# EAGLE design D1-Garage-Relay (EAGLE 9.6.2)
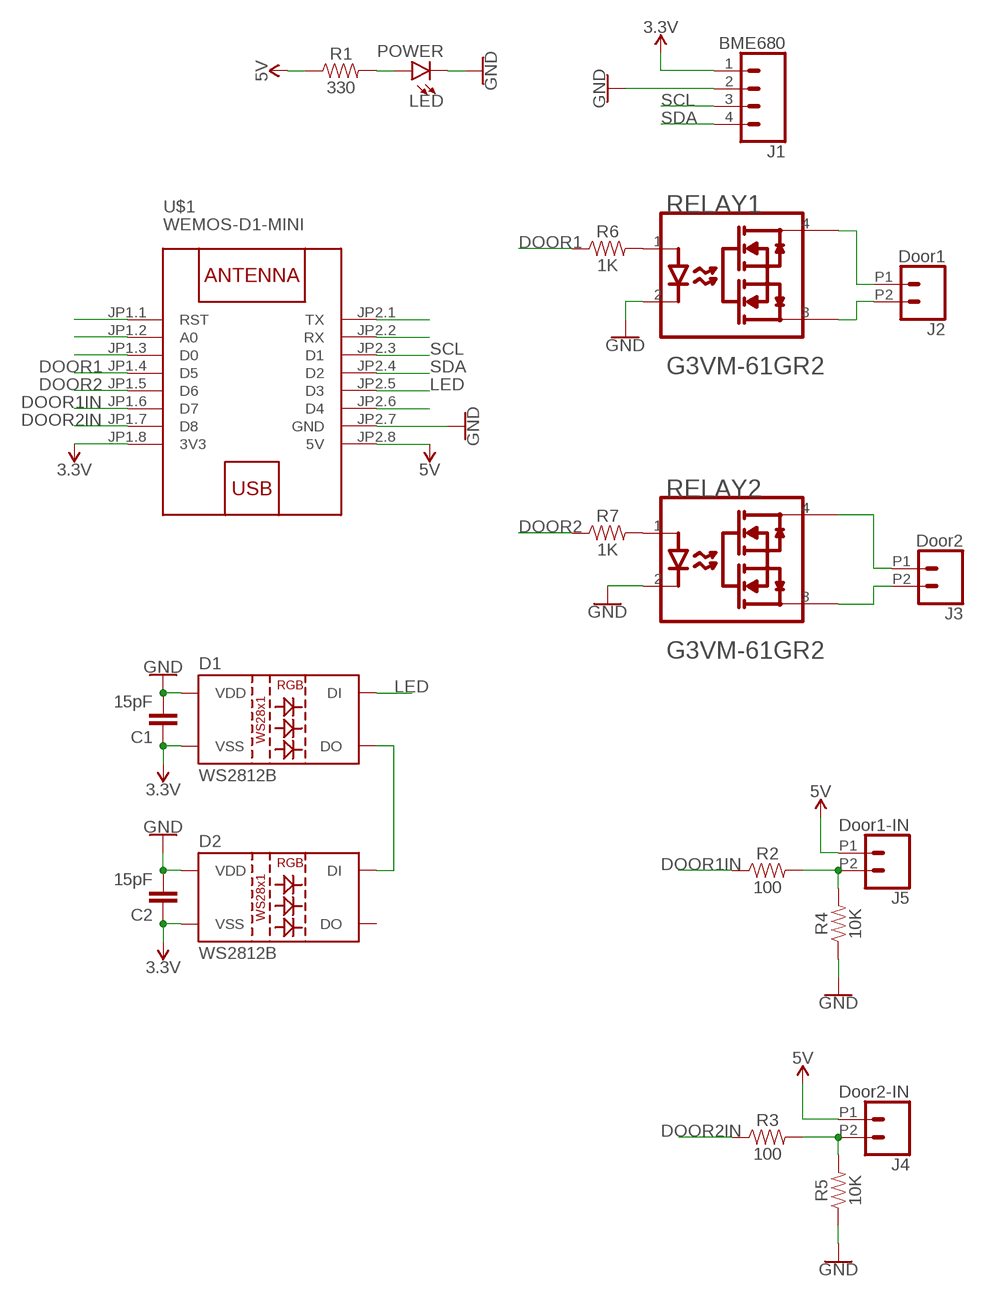
[diagram p0: schematic, sheet 1]

## Parts
C1  15pF  15PF-0603-50V-5%  [0603]
C2  15pF  15PF-0603-50V-5%  [0603]
D1  WS2812B  [WS2812B]
D2  WS2812B  [WS2812B]
J1  BME680  CONN_04  [1X04]
J2  Door1  CONN_022.54MM_SCREWTERM  [1X02_2.54_SCREWTERM]
J3  Door2  CONN_022.54MM_SCREWTERM  [1X02_2.54_SCREWTERM]
J4  Door2-IN  CONN_022.54MM_SCREWTERM  [1X02_2.54_SCREWTERM]
J5  Door1-IN  CONN_022.54MM_SCREWTERM  [1X02_2.54_SCREWTERM]
LED  POWER  LED1206  [LED-1206]
R1  330  RESISTOR0603  [0603]
R2  100  RESISTOR0603  [0603]
R3  100  RESISTOR0603  [0603]
R4  10K  RESISTOR0603  [0603]
R5  10K  RESISTOR0603  [0603]
R6  1K  RESISTOR0603  [0603]
R7  1K  RESISTOR0603  [0603]
RELAY1  AQY282SZ  OMRON_G3VM-61GR2OMRON_G3VM-61GR2_0_3  [OMRON_G3VM-61GR2_3]
RELAY2  AQY282SZ  OMRON_G3VM-61GR2OMRON_G3VM-61GR2_0_3  [OMRON_G3VM-61GR2_3]
U$1  WEMOS-D1-MINI  [WEMOS-D1-MINI]

## Nets
3.3V: C1.1 C2.1 D1.3(VSS) D2.3(VSS) J1.1 U$1.JP1.8(3V3)
5V: J4.P1 J5.P1 R1.1 U$1.JP2.8(5V)
DOOR1: R6.1 U$1.JP1.4(D5)
DOOR1IN: R2.1 U$1.JP1.6(D7)
DOOR2: R7.1 U$1.JP1.5(D6)
DOOR2IN: R3.1 U$1.JP1.7(D8)
GND: C1.2 C2.2 D1.1(VDD) D2.1(VDD) J1.2 LED.C R4.1 R5.1 RELAY1.2(CATHODE) RELAY2.2(CATHODE) U$1.JP2.7(GND)
LED: D1.4(DI) U$1.JP2.5(D3)
N$1: J2.P2 RELAY1.3(1_DRAIN)
N$2: J3.P2 RELAY2.3(1_DRAIN)
N$3: U$1.JP2.1(TX)
N$4: U$1.JP2.2(RX)
N$5: J2.P1 RELAY1.4(2_DRAIN)
N$6: R6.2 RELAY1.1(ANODE)
N$7: J3.P1 RELAY2.4(2_DRAIN)
N$8: U$1.JP2.6(D4)
N$9: R7.2 RELAY2.1(ANODE)
N$11: LED.A R1.2
N$12: J5.P2 R2.2 R4.2
N$13: J4.P2 R3.2 R5.2
N$14: D1.2(DO) D2.4(DI)
N$16: U$1.JP1.3(D0)
N$17: U$1.JP1.2(A0)
N$18: U$1.JP1.1(RST)
SCL: J1.3 U$1.JP2.3(D1)
SDA: J1.4 U$1.JP2.4(D2)
Unconnected: D2.2(DO)

## Library data of the parts
C1 C2 = SparkFun-Capacitors:15PF: 15pF ceramic capacitors A capacitor is a passive two-terminal electrical component used to store electrical energy temporarily in an electric field.; PROD_ID: CAP-07881
D1 D2 = SparkFun-LED:WS2812B: WS2812B SMD addressable RGB LED 5x5mm SMD LED with built-in controller IC. Color: Red/Green/Blue mC Rating: RGB: 390, 660, 180 mcd Forward Voltage: RGB: 2.0, 3.0, 3.0 V Packages:WS2812B SparkFun Products: Blynk Board - ESP8266 <https://www.sparkfun.com/products/13794>; PROD_ID: DIO-12503
J1 = SparkFun-Connectors:CONN_04: Multi connection point. Often used as Generic Header-pin footprint for 0.1 inch spaced/style header connections On any of the 0.1 inch spaced packages, you can populate with these: Break Away Headers - Straight <https://www.sparkfun.com/products/116> (PRT-00116) Break Away Male Headers - Right Angle <https://www.sparkfun.com/products/553> (PRT-00553) Female Headers <https://www.sparkfun.com/products/115> (PRT-00115) Break Away Headers - Machine Pin <https://www.sparkfun.com/products/117> (PRT-00117) Break Away Female Headers - Swiss Machine Pin <https://www.sparkfun.com/products/743> (PRT-00743) For SCREWTERMINALS and SPRING TERMINALS visit here: Screw Terimnals on SparkFun.com <https://www.sparkfun.com/search/results?term=Screw+Terminals> (5mm/3.5mm/2.54mm spacing) This device is also useful as a general connection point to wire up your design to another part of your project. Our various solder wires solder well into these plated through hole pads. Hook-Up Wire - Assortment (Stranded, 22 AWG) <https://www.sparkfun.com/products/11375> (PRT-11375) Hook-Up Wire - Assortment (Solid Core, 22 AWG) <https://www.sparkfun.com/products/11367> (PRT-11367) View the entire wire category on our website here <https://www.sparkfun.com/categories/141> Special notes: Molex polarized connector foot print use with SKU : PRT-08231 with associated crimp pins and housings. 1MM SMD Version SKU: PRT-10208; PROD_ID: CONN-09696
J2-J5 = SparkFun-Connectors:CONN_02: Multi connection point. Often used as Generic Header-pin footprint for 0.1 inch spaced/style header connections On any of the 0.1 inch spaced packages, you can populate with these: Break Away Headers - Straight <https://www.sparkfun.com/products/116> (PRT-00116) Break Away Male Headers - Right Angle <https://www.sparkfun.com/products/553> (PRT-00553) Female Headers <https://www.sparkfun.com/products/115> (PRT-00115) Break Away Headers - Machine Pin <https://www.sparkfun.com/products/117> (PRT-00117) Break Away Female Headers - Swiss Machine Pin <https://www.sparkfun.com/products/743> (PRT-00743) For SCREWTERMINALS and SPRING TERMINALS visit here: Screw Terimnals on SparkFun.com <https://www.sparkfun.com/search/results?term=Screw+Terminals> (5mm/3.5mm/2.54mm spacing) This device is also useful as a general connection point to wire up your design to another part of your project. Our various solder wires solder well into these plated through hole pads. Hook-Up Wire - Assortment (Stranded, 22 AWG) <https://www.sparkfun.com/products/11375> (PRT-11375) Hook-Up Wire - Assortment (Solid Core, 22 AWG) <https://www.sparkfun.com/products/11367> (PRT-11367) View the entire wire category on our website here <https://www.sparkfun.com/categories/141> Special notes: Molex polarized connector foot print use with: PRT-08233 with associated crimp pins and housings. 2.54_SCREWTERM for use with PRT-10571. 3.5mm Screw Terminal footprints for PRT-08084 5mm Screw Terminal footprints for use with PRT-08432
LED = SparkFun-LED:LED: LED (Generic) Standard schematic elements and footprints for 5mm, 3mm, 1206, and 0603 sized LEDs. Generic LEDs with no color specified.
R1-R7 = SparkFun-Resistors:RESISTOR: Generic Resistor Package
RELAY1 RELAY2 = Omron - G3VM-61GR2:OMRON_G3VM-61GR2: Solid State SPST-NO (1 Form A) 4-SOP (0.173", 4.40mm); AMBIENT_TEMPERATURE_RANGE_HIGH: +65°C; AMBIENT_TEMPERATURE_RANGE_LOW: -20°C; AUTOMOTIVE: No; CAPACITANCE: 0.8pF; CENTROID_NOT_SPECIFIED: No; DATASHEET: https://omronfs.omron.com/en_US/ecb/products/pdf/en-g3vm_61gr2.pdf; DEVICE_CLASS_L1: Electromechanical; DEVICE_CLASS_L2: Relays; DEVICE_CLASS_L3: Solid State Relays; DIGIKEY_DESCRIPTION: SSR RELAY SPST-NO 1.7A 0-60V; DIGIKEY_PART_NUMBER: Z8611-ND; FOOTPRINT_PARAMETERS_1: {"fp_type":"PSOP","params":{"N":{"nom":4,"long name":"Number of leads","min":null,"max":null,"short name":"N","type":"count"},"A":{"nom":false,"long name":"Height","min":false,"max":2100000,"short name":"A","type":"measurement"},"A1":{"nom":100000,"long name":"Package clearance","min":0,"max":200000,"short name":"A1","type":"measurement"},"A2":{"nom":false,"long name":"Package height","min":false,"max":2100000,"short name":"A2","type":"measurement"},"D":{"nom":3899999,"long name":"Package length","min":3700000,"max":4099999,"short name":"D","type":"measurement"},"E":{"nom":7000000,"long name":"Width /w leads","min":6600000,"max":7400000,"short name":"E","type":"measurement"},"E1":{"nom":4400000,"long name":"Package width","min":4150000,"max":4650000,"short name":"E1","type":"measurement"},"B":{"nom":400000,"long name":"Lead width","min":300000,"max":500000,"short name":"B","type":"measurement"},"C":{"nom":150000,"long name":"Lead thickness","min":false,"max":false,"short name":"C","type":"measurement"},"L":{"nom":600000,"long name":"Lead foot length","min":300000,"max":900000,"short name":"L","type":"measurement"},"e":{"nom":2540000,"long name":"Lead pitch","min":null,"max":null,"short name":"e","type":"measurement"},"PHI":{"nom":false,"long name":"Lead angle","min":0,"max":8,"short name":"PHI","type":"measurement"},"offset x":{"nom":0,"long name":"X Center offset","min":null,"max":null,"short name":"offset x","type":"measurement"},"offset y":{"nom":0,"long name":"Y Center offset","min":null,"max":null,"short name":"offset y","type":"measurement"},"LS":{"default":"Rounded rectangle","long name":"Land shape","type":"multichoice","short name":"LS"},"LS1":{"default":"Rectangle","long name":"Land shape (Pin 1)","type":"multichoice","short name":"LS1"},"solder toe":{"nom":550000,"long name":"Solder fillet (toe)","min":null,"max":null,"short name":"solder toe","type":"fixedmeasurement"},"solder heel":{"nom":450000,"long name":"Solder fillet (heel)","min":null,"max":null,"short name":"solder heel","type":"fixedmeasurement"},"solder side":{"nom":50000,"long name":"Solder fillet (side)","min":null,"max":null,"short name":"solder side","type":"fixedmeasurement"},"courtyard":{"nom":500000,"long name":"Courtyard","min":null,"max":null,"short name":"courtyard","type":"fixedmeasurement"},"SF":{"default":"A (> 0.625mm pitch)","long name":"Packing level","type":"multichoiceparent","short name":"SF","help":"http://support.upverter.com/customer/portal/articles/978783-what-is-a-footprint-packing-level","children":["solder toe","solder heel","solder side","courtyard"]}}}; FOOTPRINT_PARAMETERS_2: {"fp_type":"PSOP","params":{"N":{"nom":4,"long name":"Number of leads","min":null,"max":null,"short name":"N","type":"count"},"A":{"nom":false,"long name":"Height","min":false,"max":2100000,"short name":"A","type":"measurement"},"A1":{"nom":100000,"long name":"Package clearance","min":0,"max":200000,"short name":"A1","type":"measurement"},"A2":{"nom":false,"long name":"Package height","min":false,"max":2100000,"short name":"A2","type":"measurement"},"D":{"nom":3899999,"long name":"Package length","min":3700000,"max":4099999,"short name":"D","type":"measurement"},"E":{"nom":7000000,"long name":"Width /w leads","min":6600000,"max":7400000,"short name":"E","type":"measurement"},"E1":{"nom":4400000,"long name":"Package width","min":4150000,"max":4650000,"short name":"E1","type":"measurement"},"B":{"nom":400000,"long name":"Lead width","min":300000,"max":500000,"short name":"B","type":"measurement"},"C":{"nom":150000,"long name":"Lead thickness","min":false,"max":false,"short name":"C","type":"measurement"},"L":{"nom":600000,"long name":"Lead foot length","min":300000,"max":900000,"short name":"L","type":"measurement"},"e":{"nom":2540000,"long name":"Lead pitch","min":null,"max":null,"short name":"e","type":"measurement"},"PHI":{"nom":false,"long name":"Lead angle","min":0,"max":8,"short name":"PHI","type":"measurement"},"offset x":{"nom":0,"long name":"X Center offset","min":null,"max":null,"short name":"offset x","type":"measurement"},"offset y":{"nom":0,"long name":"Y Center offset","min":null,"max":null,"short name":"offset y","type":"measurement"},"LS":{"default":"Rounded rectangle","long name":"Land shape","type":"multichoice","short name":"LS"},"LS1":{"default":"Rectangle","long name":"Land shape (Pin 1)","type":"multichoice","short name":"LS1"},"solder toe":{"nom":350000,"long name":"Solder fillet (toe)","min":null,"max":null,"short name":"solder toe","type":"fixedmeasurement"},"solder heel":{"nom":350000,"long name":"Solder fillet (heel)","min":null,"max":null,"short name":"solder heel","type":"fixedmeasurement"},"solder side":{"nom":30000,"long name":"Solder fillet (side)","min":null,"max":null,"short name":"solder side","type":"fixedmeasurement"},"courtyard":{"nom":250000,"long name":"Courtyard","min":null,"max":null,"short name":"courtyard","type":"fixedmeasurement"},"SF":{"default":"B (> 0.625mm pitch)","long name":"Packing level","type":"multichoiceparent","short name":"SF","help":"http://support.upverter.com/customer/portal/articles/978783-what-is-a-footprint-packing-level","children":["solder toe","solder heel","solder side","courtyard"]}}}; FOOTPRINT_PARAMETERS_3: {"fp_type":"PSOP","params":{"N":{"nom":4,"long name":"Number of leads","min":null,"max":null,"short name":"N","type":"count"},"A":{"nom":false,"long name":"Height","min":false,"max":2100000,"short name":"A","type":"measurement"},"A1":{"nom":100000,"long name":"Package clearance","min":0,"max":200000,"short name":"A1","type":"measurement"},"A2":{"nom":false,"long name":"Package height","min":false,"max":2100000,"short name":"A2","type":"measurement"},"D":{"nom":3899999,"long name":"Package length","min":3700000,"max":4099999,"short name":"D","type":"measurement"},"E":{"nom":7000000,"long name":"Width /w leads","min":6600000,"max":7400000,"short name":"E","type":"measurement"},"E1":{"nom":4400000,"long name":"Package width","min":4150000,"max":4650000,"short name":"E1","type":"measurement"},"B":{"nom":400000,"long name":"Lead width","min":300000,"max":500000,"short name":"B","type":"measurement"},"C":{"nom":150000,"long name":"Lead thickness","min":false,"max":false,"short name":"C","type":"measurement"},"L":{"nom":600000,"long name":"Lead foot length","min":300000,"max":900000,"short name":"L","type":"measurement"},"e":{"nom":2540000,"long name":"Lead pitch","min":null,"max":null,"short name":"e","type":"measurement"},"PHI":{"nom":false,"long name":"Lead angle","min":0,"max":8,"short name":"PHI","type":"measurement"},"offset x":{"nom":0,"long name":"X Center offset","min":null,"max":null,"short name":"offset x","type":"measurement"},"offset y":{"nom":0,"long name":"Y Center offset","min":null,"max":null,"short name":"offset y","type":"measurement"},"LS":{"default":"Rounded rectangle","long name":"Land shape","type":"multichoice","short name":"LS"},"LS1":{"default":"Rectangle","long name":"Land shape (Pin 1)","type":"multichoice","short name":"LS1"},"solder toe":{"nom":150000,"long name":"Solder fillet (toe)","min":null,"max":null,"short name":"solder toe","type":"fixedmeasurement"},"solder heel":{"nom":250000,"long name":"Solder fillet (heel)","min":null,"max":null,"short name":"solder heel","type":"fixedmeasurement"},"solder side":{"nom":10000,"long name":"Solder fillet (side)","min":null,"max":null,"short name":"solder side","type":"fixedmeasurement"},"courtyard":{"nom":100000,"long name":"Courtyard","min":null,"max":null,"short name":"courtyard","type":"fixedmeasurement"},"SF":{"default":"C (> 0.625mm pitch)","long name":"Packing level","type":"multichoiceparent","short name":"SF","help":"http://support.upverter.com/customer/portal/articles/978783-what-is-a-footprint-packing-level","children":["solder toe","solder heel","solder side","courtyard"]}}}; FOOTPRINT_VARIANT_NAME_0: Recommended_Land_Pattern; FOOTPRINT_VARIANT_NAME_1: IPC_A; FOOTPRINT_VARIANT_NAME_2: IPC_B; FOOTPRINT_VARIANT_NAME_3: IPC_C; HEIGHT: 2.1mm; INPUT_CURRENT: 10mA; IPC_LAND_PATTERN_NAME: SOP254P700X210-4; ISOLATION_VOLTAGE: 1500Vrms; LEAD_FREE: Yes; MAX_JUNCTION_TEMP: +125°C; MF: Omron; MFG_PACKAGE_IDENT: 0; MFG_PACKAGE_IDENT_DATE: 0; MFG_PACKAGE_IDENT_REV: 0; MOUSER_DESCRIPTION: Relay SSR 25mA 1.48V DC-IN 1.3A 48V AC/DC-OUT 4-Pin SOP T/R; MOUSER_PART_NUMBER: 653-G3VM61GR2; MPN: G3VM-61GR2; NUMBER_OF_CONTACTS: 1; ON_STATE_RESISTANCE: 0.08Ω; OUTPUT_CURRENT: 1.3A; OUTPUT_VOLTAGE: 48V; PACKAGE: SOP4; PREFIX: K; ROHS: Yes; STANDOFF_HEIGHT: 0mm; TEMPERATURE_RANGE_HIGH: +65°C; TEMPERATURE_RANGE_LOW: -20°C; THROW_CONFIGURATION: SPST-NO; VERIFICATION_VERSION: 0.0.0.3
U$1 = diy-modules:WEMOS-D1-MINI: WEMOS D1 mini: Mini Wi-Fi Board based on ESP-8266 device More details can be found here: https://www.wemos.cc/product/d1-mini.html Click here to find device on ebay.com <http://www.ebay.com/sch/wemos+d1+mini+nodemcu>

## Board
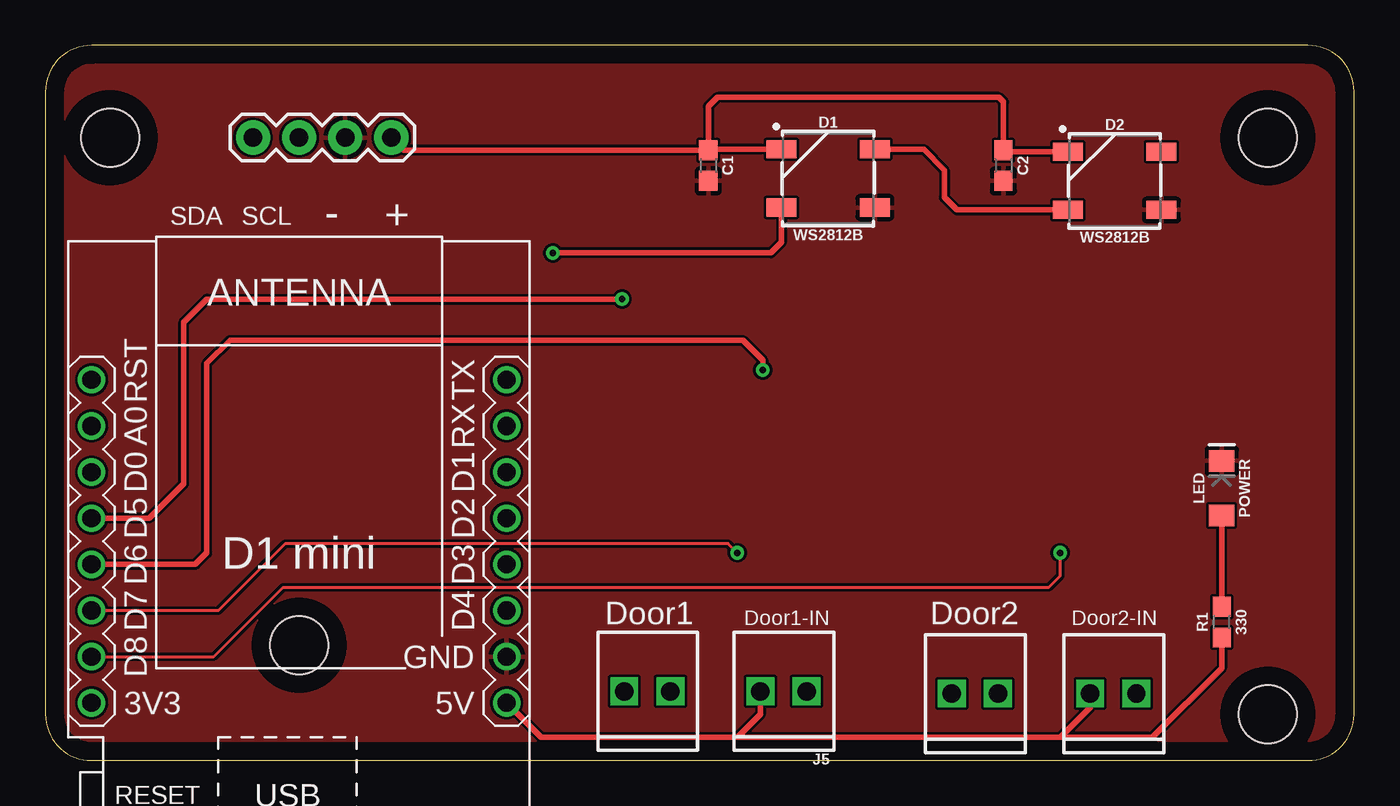
[diagram p1: board, top side]
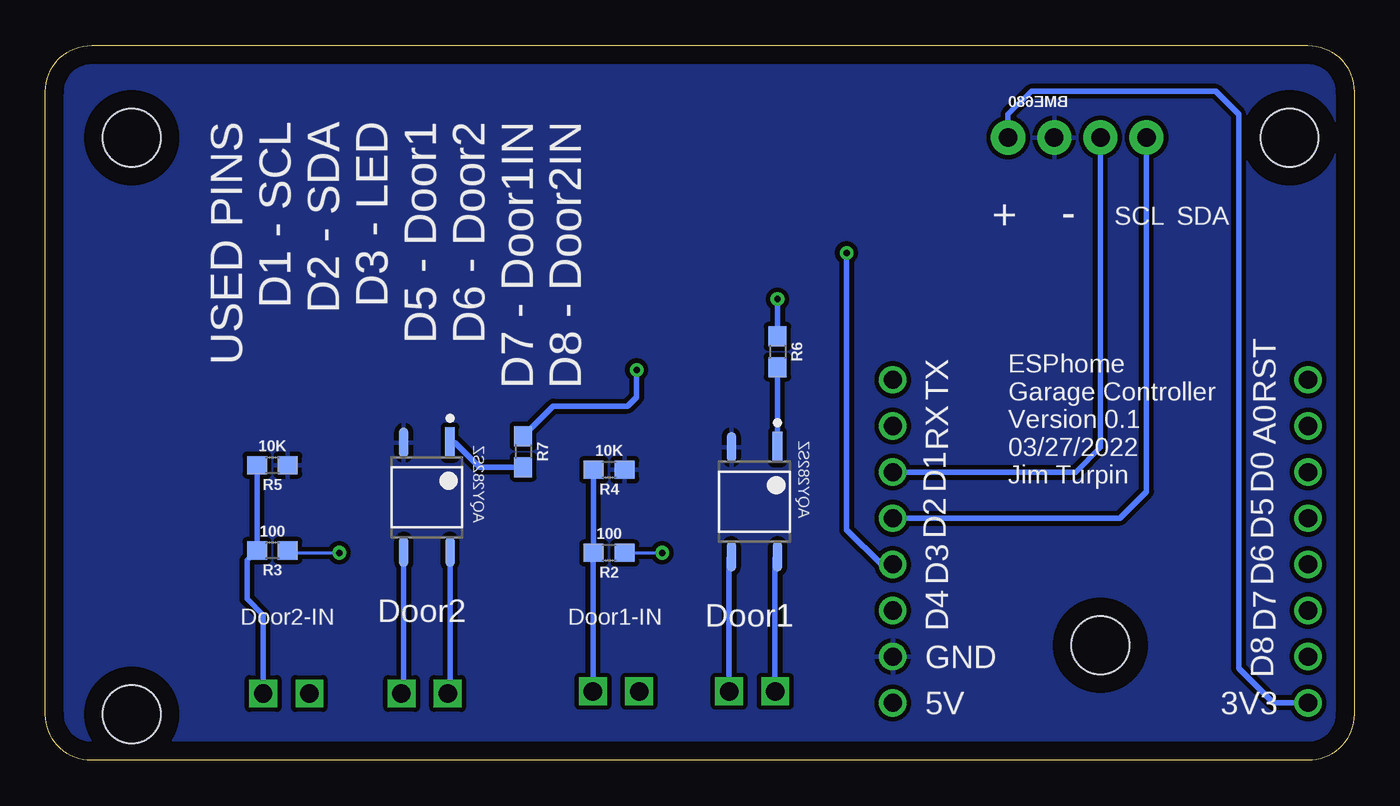
[diagram p2: board, bottom side, seen from below]

Size 72.06 x 39.36 mm. Coordinates in mm from the lower left corner, seen from the top.
Outline: 0,36.82 0,2.54 arc90 2.54,0 69.52,0 arc90 72.06,2.54 72.06,36.82 arc90 69.52,39.36 2.54,39.36 arc90 0,36.82
Copper layers (1*16): Top 0.035mm / dielectric 1.5mm / Bottom 0.035mm
Design rules "default": minimum track width 6mil, minimum drill 0.35mm, track to track 6mil, track to pad 6mil, pad to pad 6mil, via to via 6mil, smd to smd 6mil, copper to edge 40mil, drill to drill 6mil, minimum pad ring 10mil, minimum via ring 8mil, stop-mask expansion 4mil, vias tented up to drill 0mil, thermal gap 10mil
Holes 3.2 mm at 3.56,34.29 67.31,34.29 67.31,2.54 13.97,6.35

### Footprints (pad centres in the part's own frame; a part is rotated, then mirrored left to right if it is on the bottom)
0603 = smd 1.1 x 1: 1 -0.85,0; 2 0.85,0
WS2812B = smd 1.651 x 1: 1 2.577,-1.6; 2 2.577,1.6; 3 -2.577,1.6; 4 -2.577,-1.6
1X04 = drill 1.016 pad 1.88: 1 0,0; 2 2.54,0; 3 5.08,0; 4 7.62,0
1X02_2.54_SCREWTERM = drill 1.016 square: P1 2.54,0; P2 0,0
LED-1206 = smd 1.2 x 1.4: A -1.5,0; C 1.5,0
OMRON_G3VM-61GR2_3 = smd 1.703 x 0.532: 1 -3,1.27; 2 -3,-1.27; 3 3,-1.27; 4 3,1.27
WEMOS-D1-MINI = drill 1: JP1.1 -11.43,9.525; JP1.2 -11.43,6.985; JP1.3 -11.43,4.445; JP1.4 -11.43,1.905; JP1.5 -11.43,-0.635; JP1.6 -11.43,-3.175; JP1.7 -11.43,-5.715; JP1.8 -11.43,-8.255; JP2.1 11.43,9.525; JP2.2 11.43,6.985; JP2.3 11.43,4.445; JP2.4 11.43,1.905; JP2.5 11.43,-0.635; JP2.6 11.43,-3.175; JP2.7 11.43,-5.715; JP2.8 11.43,-8.255

### Placement (x,y rotation side)
C1  36.5,32.75 270 top
C2  52.75,32.75 270 top
D1  43.1,32.04 0 top
D2  58.88,31.91 0 top
J1  19.05,34.29 180 top
J2  34.42,3.81 180 top
J3  52.45,3.68 180 top
J4  60.07,3.68 180 top
J5  41.91,3.81 180 top
LED  64.77,14.99 90 top
R1  64.77,7.62 90 top
R2  41.02,11.43 180 bottom
R3  59.56,11.56 180 bottom
R4  41.02,16 180 bottom
R5  59.56,16.26 180 bottom
R6  31.75,22.5 270 bottom
R7  45.75,17 270 bottom
RELAY1  33.02,14.25 270 bottom
RELAY2  51.05,14.49 270 bottom
U$1  13.97,11.43 0 top

### Tracks (layer width: path | path; a pad name or v marks a point on that pad's centre or on a via)
3.3V
  Top 0.305: D1.3 36.54,33.64 C1.1 | C1.1 19.74,33.6 J1.1 | C1.1 36.5,36 37,36.5 52.5,36.5 52.75,36.25 C2.1 52.84,33.51 D2.3
  Bottom 0.305: U$1.JP1.8 4.45,3.17 6.35,5.08 6.35,35.56 7.62,36.83 17.78,36.83 19.05,35.56 J1.1
5V
  Top 0.305: U$1.JP2.8 27.3,1.27 38.1,1.27 | 55.88,1.27 57.53,2.92 J4.P1 | 38.1,1.27 55.88,1.27 | J5.P1 39.37,2.54 38.1,1.27 | R1.1 64.77,5.08 60.96,1.27 55.88,1.27
DOOR1  (via drill 0.35)
  Top 0.305: U$1.JP1.4 5.71,13.34 7.62,15.24 7.62,24.13 8.89,25.4 v31.75,25.4
  Bottom 0.305: v31.75,25.4 R6.1
DOOR1IN  (via drill 0.35)
  Top 0.152: v38.1,11.43 37.59,11.94 13.21,11.94 9.53,8.26 U$1.JP1.6
  Bottom 0.152: R2.1 v38.1,11.43
DOOR2  (via drill 0.35)
  Top 0.305: U$1.JP1.5 8.26,10.79 8.89,11.43 8.89,21.86 10.16,23.13 38.41,23.13 39.5,22.04 v39.5,21.5
  Bottom 0.305: R7.1 44.1,19.5 40,19.5 39.5,20 39.5,20.18 39.5,20.5 v39.5,21.5
DOOR2IN  (via drill 0.35)
  Top 0.152: U$1.JP1.7 9.27,5.71 13.08,9.53 55.24,9.53 55.88,10.16 v55.88,11.43
  Bottom 0.152: R3.1 58.59,11.43 v55.88,11.43
GND
  pour Bottom (isolate 0.254): 0,2.54 0,36.83 arc-90 2.54,39.37 69.85,39.37 arc-90 72.39,36.83 72.39,2.54 arc-90 69.85,0 2.54,0 arc-90
  pour Top: 0,0 0,39.37 72.39,39.37 72.39,0
LED  (via drill 0.35)
  Top 0.305: D1.4 40.52,28.52 39.94,27.94 v27.94,27.94
  Bottom 0.305: U$1.JP2.5 26.04,10.79 27.94,12.7 v27.94,27.94
N$1
  Bottom 0.305: RELAY1.3 34.42,11.12 J2.P2
N$2
  Bottom 0.305: RELAY2.3 52.32,3.81 J3.P2
N$5
  Bottom 0.305: RELAY1.4 31.88,11.12 J2.P1
N$6
  Bottom 0.305: RELAY1.1 R6.2
N$7
  Bottom 0.305: RELAY2.4 49.78,3.81 J3.P1
N$9
  Bottom 0.305: R7.2 48.15,16.15 49.49,17.49 RELAY2.1
N$11
  Top 0.305: R1.2 LED.A
N$12
  Bottom 0.305: J5.P2 41.91,11.39 R2.2 R4.2
N$13
  Bottom 0.305: J4.P2 60.07,8 60.96,8.89 60.96,11.01 R3.2 R5.2
N$14
  Top 0.305: D1.2 48.36,33.64 49.5,32.5 49.5,31 50.19,30.31 D2.4
SCL
  Bottom 0.305: U$1.JP2.3 15.33,15.88 13.97,17.23 J1.3
SDA
  Bottom 0.305: U$1.JP2.4 12.9,13.34 11.43,14.8 J1.4

### Text on the board
tNames: SDA | SCL | - | +
bNames: USED PINS / D1 - SCL / D2 - SDA / D3 - LED / D5 - Door1 / D6 - Door2 / D7 - Door1IN / D8 - Door2IN | SDA | SCL | - | + | TX | RST | RX | A0 | D1 | D0 | ESPhome / Garage Controller / Version 0.1 / 03/27/2022 / Jim Turpin | D2 | AQY282SZ | AQY282SZ | D5 | D3 | D6 | D4 | Door1 | Door2 | Door1-IN | Door2-IN | D7 | GND | D8 | 3V3 | 5V